# Altium project ArmDebuger_V0.5.PrjPcb
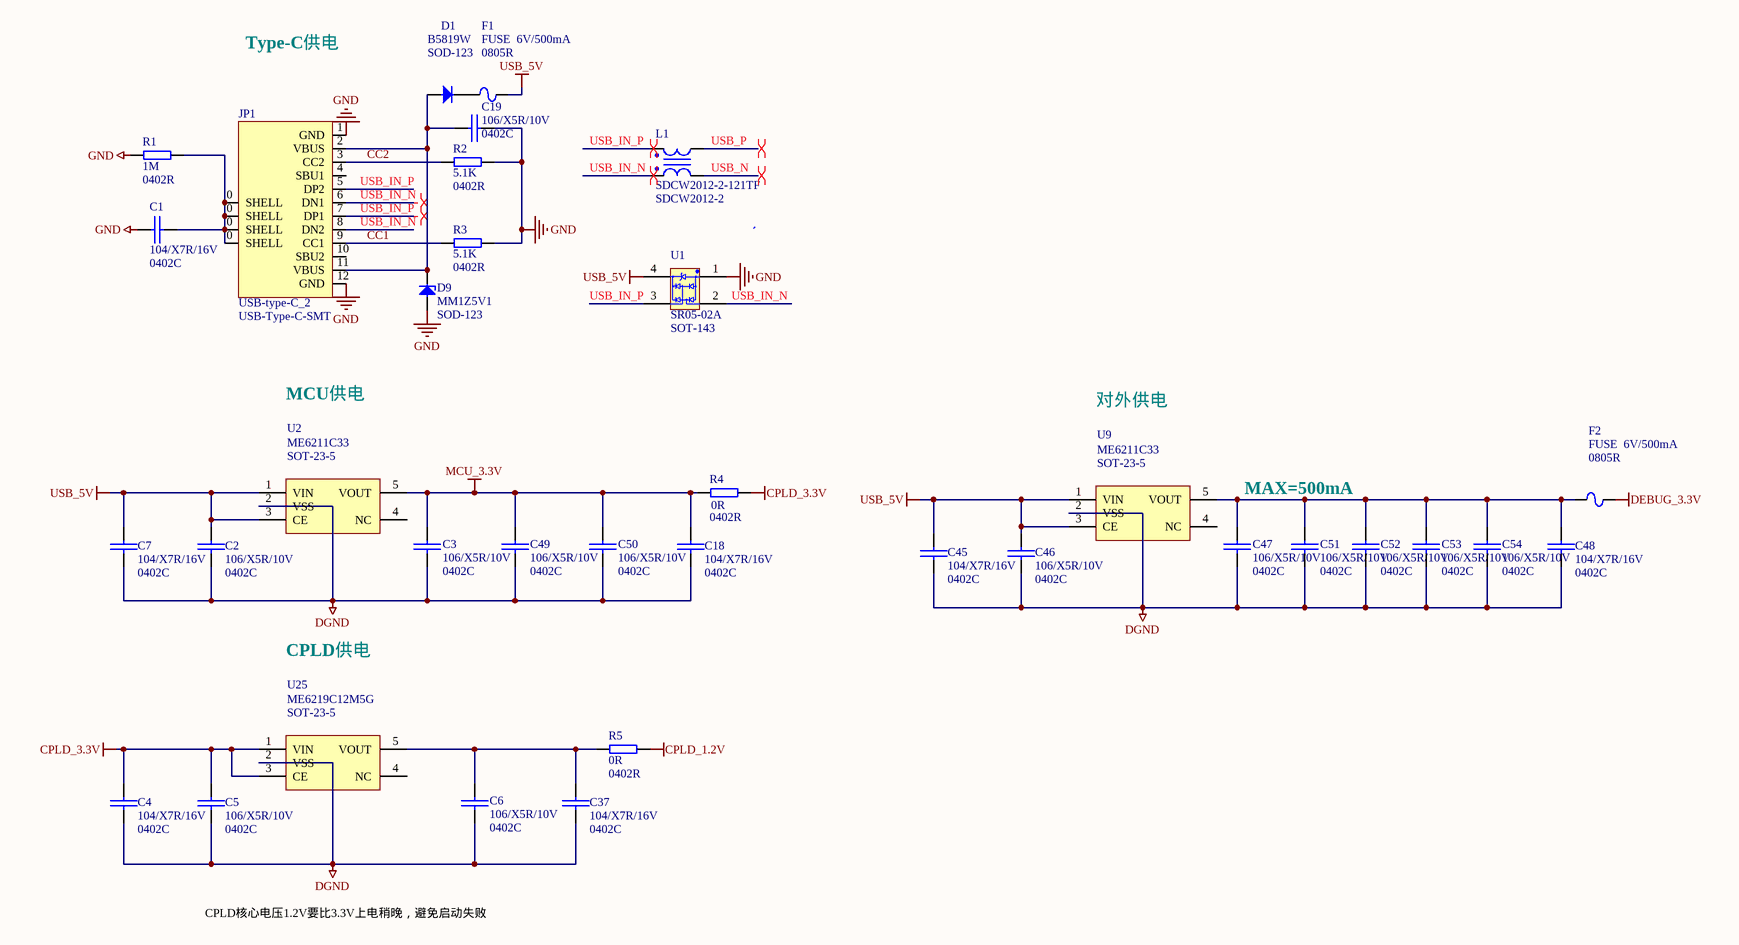
[diagram p0: ArmDebuger(1-7)-POWER.SchDoc]
7 sheets, 167 parts. Net scope: global (net labels, ports and power ports of the same name join across sheets).
Board files: ArmDebuger.PcbDoc, 丝印.PcbDoc
Sheets:
  ArmDebuger(1-7)-POWER.SchDoc
  ArmDebuger(2-7)-HUB.SchDoc
  ArmDebuger(3-7)STLink_V2.SchDoc
  ArmDebuger(4-7)JLink_V9.SchDoc
  ArmDebuger(5-7)DAPLink_V2.SchDoc
  ArmDebuger(6-7)Port.SchDoc
  ArmDebuger(7-7)-CPLD.SchDoc

## Sheet ArmDebuger(1-7)-POWER.SchDoc
size 393 x 241 mm

### Parts
C1  104/X7R/16V  Fp: 0402C  [0402C-SMD-M]
C2  106/X5R/10V  Fp: 0402C  [0402C-SMD-M]
C3  106/X5R/10V  Fp: 0402C  [0402C-SMD-M]
C4  104/X7R/16V  Fp: 0402C  [0402C-SMD-M]
C5  106/X5R/10V  Fp: 0402C  [0402C-SMD-M]
C6  106/X5R/10V  Fp: 0402C  [0402C-SMD-M]
C7  104/X7R/16V  Fp: 0402C  [0402C-SMD-M]
C18  104/X7R/16V  Fp: 0402C  [0402C-SMD-M]
C19  106/X5R/10V  Fp: 0402C  [0402C-SMD-M]
C37  104/X7R/16V  Fp: 0402C  [0402C-SMD-M]
C45  104/X7R/16V  Fp: 0402C  [0402C-SMD-M]
C46  106/X5R/10V  Fp: 0402C  [0402C-SMD-M]
C47  106/X5R/10V  Fp: 0402C  [0402C-SMD-M]
C48  104/X7R/16V  Fp: 0402C  [0402C-SMD-M]
C49  106/X5R/10V  Fp: 0402C  [0402C-SMD-M]
C50  106/X5R/10V  Fp: 0402C  [0402C-SMD-M]
C51  106/X5R/10V  Fp: 0402C  [0402C-SMD-M]
C52  106/X5R/10V  Fp: 0402C  [0402C-SMD-M]
C53  106/X5R/10V  Fp: 0402C  [0402C-SMD-M]
C54  106/X5R/10V  Fp: 0402C  [0402C-SMD-M]
D1  B5819W  [SOD-123]
D9  MM1Z5V1  [SOD-123]
F1  FUSE  6V/500mA  Fp: 0805R  [0805R-SMD-M]
F2  FUSE  6V/500mA  Fp: 0805R  [0805R-SMD-M]
JP1  USB-type-C_2  [USB-Type-C-SMT]
L1  SDCW2012-2-121TF  [SDCW2012-2]
R1  1M  Fp: 0402R  [0402R-SMD-M]
R2  5.1K  Fp: 0402R  [0402R-SMD-M]
R3  5.1K  Fp: 0402R  [0402R-SMD-M]
R4  0R  Fp: 0402R  [0402R-SMD-M]
R5  0R  Fp: 0402R  [0402R-SMD-M]
U1  SR05-02A  [SOT-143]
U2  ME6211C33  [SOT-23-5]
U9  ME6211C33  [SOT-23-5]
U25  ME6219C12M5G  [SOT-23-5]

### Nets
CPLD_1.2V: R5.2
CPLD_3.3V: C4.2 C5.2 R4.2 U25.1(VIN) U25.3(CE)
DEBUG_3.3V: F2.2
DGND: C1.1 C2.1 C3.2 C4.1 C5.1 C6.2 C7.1 C18.1 C19.2 C37.1 C45.1 C46.1 C47.2 C48.1 C49.2 C50.2 C51.2 C52.2 C53.2 C54.2 D9.1(A) JP1.1(GND) JP1.12(GND) R1.1 R2.2 R3.2 U1.1 U2.2(VSS) U9.2(VSS) U25.2(VSS)  [also labelled GND]
MCU_3.3V: C3.1 C18.2 C49.1 C50.1 R4.1 U2.5(VOUT)
USB_5V: C2.2 C7.2 C45.2 C46.2 F1.2 U1.4 U2.1(VIN) U2.3(CE) U9.1(VIN) U9.3(CE)
CC1: JP1.9(CC1) R3.1
CC2: JP1.3(CC2) R2.1
USB_IN_N: JP1.6(DN1) JP1.8(DN2) L1.1 U1.2
USB_IN_P: JP1.5(DP2) JP1.7(DP1) L1.4 U1.3
USB_N: L1.2
USB_P: L1.3
NetC1_2: C1.2 JP1.0(SHELL) R1.2
NetC6_1: C6.1 C37.2 R5.1 U25.5(VOUT)
NetC19_1: C19.1 D1.1(A) D9.2(K) JP1.2(VBUS) JP1.11(VBUS)
NetC47_1: C47.1 C48.2 C51.1 C52.1 C53.1 C54.1 F2.1 U9.5(VOUT)
NetD1_2: D1.2(K) F1.1

Not connected (* = marked no-connect by the designer): JP1 4(SBU1) 10(SBU2); U2 4(NC); U9 4(NC); U25 4(NC)

### Layout directives
differential pair: USB_IN_N, USB_IN_P, USB_N, USB_P

### Notes on the sheet
- Type-C供电
- MCU供电
- 对外供电
- MAX=500mA
- CPLD供电
- CPLD核心电压1.2V要比3.3V上电稍晚，避免启动失败

### Library data of the parts
C1 C4 C7 C18 C37 C45 C48 = CAP: P/N: 06075; LCSC: C60474
C2 C3 C5 C6 C19 C46 C47 C49-C54 = CAP: LCSC: C29266; P/N: ?
D1 = DIODE: P/N: 02036; Fp: SOD-123; LCSC: C8598
D9 = ZENER: P/N: 02031; Fp: SOD-123; LCSC: C112534
F1 F2 = FUSE: LCSC: C66452; P/N: ?
L1 = COMMON MODE COIL: P/N: 09016; Fp: SDCW2012-2; LCSC: C145052
R1 = RES: P/N: 04075; LCSC: C3152068
R2 R3 = RES: P/N: 04160; LCSC: C25905
R4 R5 = RES: P/N: 04150; LCSC: C21376
U1 = SR05-02A: P/N: 02064; Fp: SOT-143; LCSC: C521962
U2 U9 = ME6211: P/N: 01053; Fp: SOT-23-5; LCSC: C82942
U25 = ME6211: P/N: 01128; Fp: SOT-23-5; LCSC: C236651
JP1 = USB-type-C_2: Fp: USB-Type-C-SMT; LCSC: C2765186; P/N: ?

## Sheet ArmDebuger(2-7)-HUB.SchDoc
size 393 x 241 mm
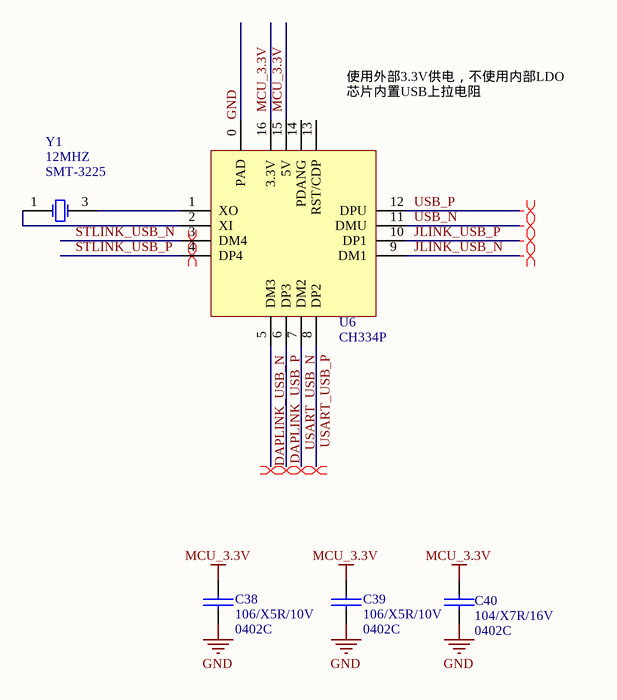
[diagram p1: ArmDebuger(2-7)-HUB.SchDoc]

### Parts
C38  106/X5R/10V  Fp: 0402C  [0402C-SMD-M]
C39  106/X5R/10V  Fp: 0402C  [0402C-SMD-M]
C40  104/X7R/16V  Fp: 0402C  [0402C-SMD-M]
U6  CH334P  [QFN-16]
Y1  12MHZ  Fp: SMT-3225  [CRYSTAL-SMT-3225]

### Nets
GND: C38.2 C39.2 C40.1 U6.0(PAD)  [project net DGND]
MCU_3.3V: C38.1 C39.1 C40.2 U6.15(5V) U6.16(3.3V)
DAPLINK_USB_N: U6.5(DM3)
DAPLINK_USB_P: U6.6(DP3)
JLINK_USB_N: U6.9(DM1)
JLINK_USB_P: U6.10(DP1)
STLINK_USB_N: U6.3(DM4)
STLINK_USB_P: U6.4(DP4)
USART_USB_N: U6.7(DM2)
USART_USB_P: U6.8(DP2)
USB_N: U6.11(DMU)
USB_P: U6.12(DPU)
NetU6_1: U6.1(XO) Y1.3(OSC2)
NetU6_2: U6.2(XI) Y1.1(OSC1)

Not connected (* = marked no-connect by the designer): U6 13(RST/CDP) 14(PDANG)

### Layout directives
differential pair: DAPLINK_USB_N, DAPLINK_USB_P, JLINK_USB_N, JLINK_USB_P, STLINK_USB_N, STLINK_USB_P, USART_USB_N, USART_USB_P, USB_N, USB_P

### Notes on the sheet
- (near U6) 使用外部3.3V供电，不使用内部LDO
  芯片内置USB上拉电阻

### Library data of the parts
C38 C39 = CAP: LCSC: C29266; P/N: ?
C40 = CAP: P/N: 06075; LCSC: C60474
Y1 = SMD-3225_4P  25MHZ 12PF 10PPM: 贴片晶振; P/N: 10009; LCSC: C133334
U6 = CH334P: Fp: QFN-16; P/N: ?; taobao: https://m.tb.cn/h.5UjuFds?tk=QfBrWaFip8v

## Sheet ArmDebuger(3-7)STLink_V2.SchDoc
size 393 x 241 mm
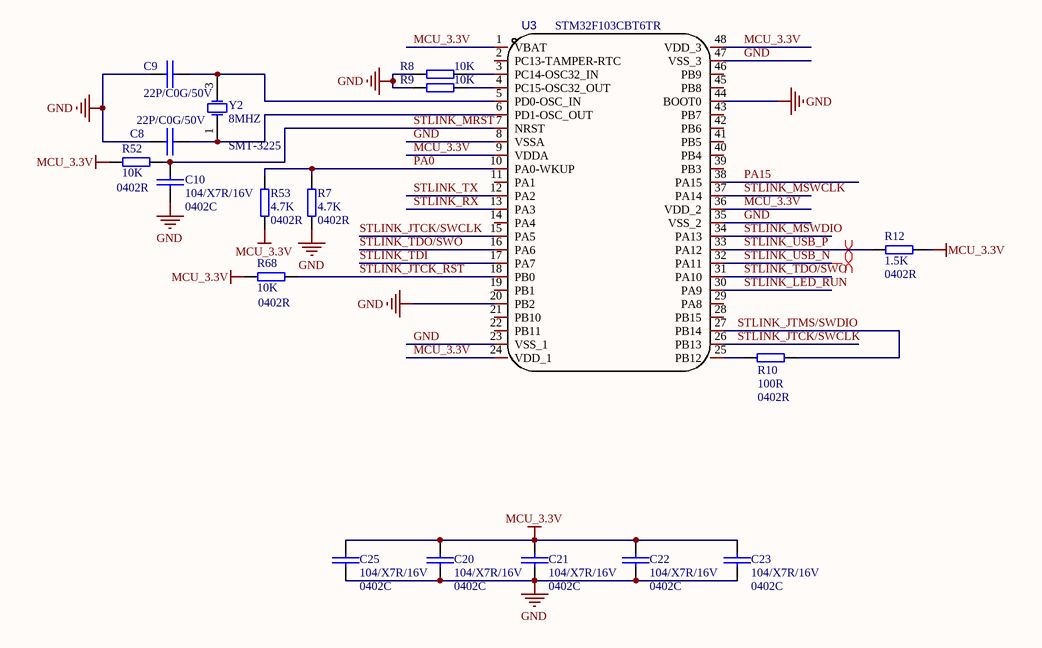
[diagram p2: ArmDebuger(3-7)STLink_V2.SchDoc]

### Parts
C8  22P/C0G/50V  [0402C-SMD-M]
C9  22P/C0G/50V  [0402C-SMD-M]
C10  104/X7R/16V  Fp: 0402C  [0402C-SMD-M]
C20  104/X7R/16V  Fp: 0402C  [0402C-SMD-M]
C21  104/X7R/16V  Fp: 0402C  [0402C-SMD-M]
C22  104/X7R/16V  Fp: 0402C  [0402C-SMD-M]
C23  104/X7R/16V  Fp: 0402C  [0402C-SMD-M]
C25  104/X7R/16V  Fp: 0402C  [0402C-SMD-M]
R7  4.7K  Fp: 0402R  [0402R-SMD-M]
R8  10K  [0402R-SMD-M]
R9  10K  [0402R-SMD-M]
R10  100R  Fp: 0402R  [0402R-SMD-M]
R12  1.5K  Fp: 0402R  [0402R-SMD-M]
R52  10K  Fp: 0402R  [0402R-SMD-M]
R53  4.7K  Fp: 0402R  [0402R-SMD-M]
R68  10K  Fp: 0402R  [0402R-SMD-M]
U3  STM32F103CBT6TR  [LQFP48_L]
Y2  8MHZ  Fp: SMT-3225  [CRYSTAL-SMT-3225]

### Nets
GND: C8.1 C9.1 C10.1 C20.1 C21.1 C22.1 C23.1 C25.1 R7.1 R8.1 R9.1 U3.8(VSSA) U3.20(PB2) U3.23(VSS_1) U3.35(VSS_2) U3.44(BOOT0) U3.47(VSS_3)  [project net DGND]
MCU_3.3V: C20.2 C21.2 C22.2 C23.2 C25.2 R12.1 R52.1 R53.1 R68.1 U3.1(VBAT) U3.9(VDDA) U3.24(VDD_1) U3.36(VDD_2) U3.48(VDD_3)
PA0: R7.2 R53.2 U3.10(PA0-WKUP)
PA15: U3.38(PA15)
STLINK_JTCK/SWCLK: U3.15(PA5) U3.26(PB13)
STLINK_JTCK_RST: R68.2 U3.18(PB0)
STLINK_JTMS/SWDIO: R10.2 U3.27(PB14)
STLINK_LED_RUN: U3.30(PA9)
STLINK_MRST: C10.2 R52.2 U3.7(NRST)
STLINK_MSWCLK: U3.37(PA14)
STLINK_MSWDIO: U3.34(PA13)
STLINK_RX: U3.13(PA3)
STLINK_TDI: U3.17(PA7)
STLINK_TDO/SWO: U3.16(PA6) U3.31(PA10)
STLINK_TX: U3.12(PA2)
STLINK_USB_N: U3.32(PA11)
STLINK_USB_P: R12.2 U3.33(PA12)
NetC8_2: C8.2 U3.6(PD1-OSC_OUT) Y2.1(OSC1)
NetC9_2: C9.2 U3.5(PD0-OSC_IN) Y2.3(OSC2)
NetR8_2: R8.2 U3.3(PC14-OSC32_IN)
NetR9_2: R9.2 U3.4(PC15-OSC32_OUT)
NetR10_1: R10.1 U3.25(PB12)

Not connected (* = marked no-connect by the designer): U3 2(PC13-TAMPER-RTC) 11(PA1) 14(PA4) 19(PB1) 21(PB10) 22(PB11) 28(PB15) 29(PA8) 39(PB3) 40(PB4) 41(PB5) 42(PB6) 43(PB7) 45(PB8) 46(PB9)

### Layout directives
differential pair: STLINK_USB_N, STLINK_USB_P

### Library data of the parts
C8 C9 = CAP: Fp: 0402C; P/N: 06076; LCSC: C167428
C10 C20-C23 C25 = CAP: P/N: 06075; LCSC: C60474
R7 R53 = RES: P/N: 04156; LCSC: C25900
R8 R9 = RES: Fp: 0402R; P/N: 04120; LCSC: C25744
R10 = RES: P/N: 04154; LCSC: C106232
R12 = RES: P/N: 04163; LCSC: C25867
R52 R68 = RES: P/N: 04120; LCSC: C25744
U3 = STM32F103C8T6TR: Fp: LQFP48; P/N: ?; taobao: https://m.tb.cn/h.5UjFpJ6?tk=nM8UWaFiXVg
Y2 = SMD-3225_4P  25MHZ 12PF 10PPM: 贴片晶振; LCSC: C5308002; P/N: ?

## Sheet ArmDebuger(4-7)JLink_V9.SchDoc
size 393 x 241 mm
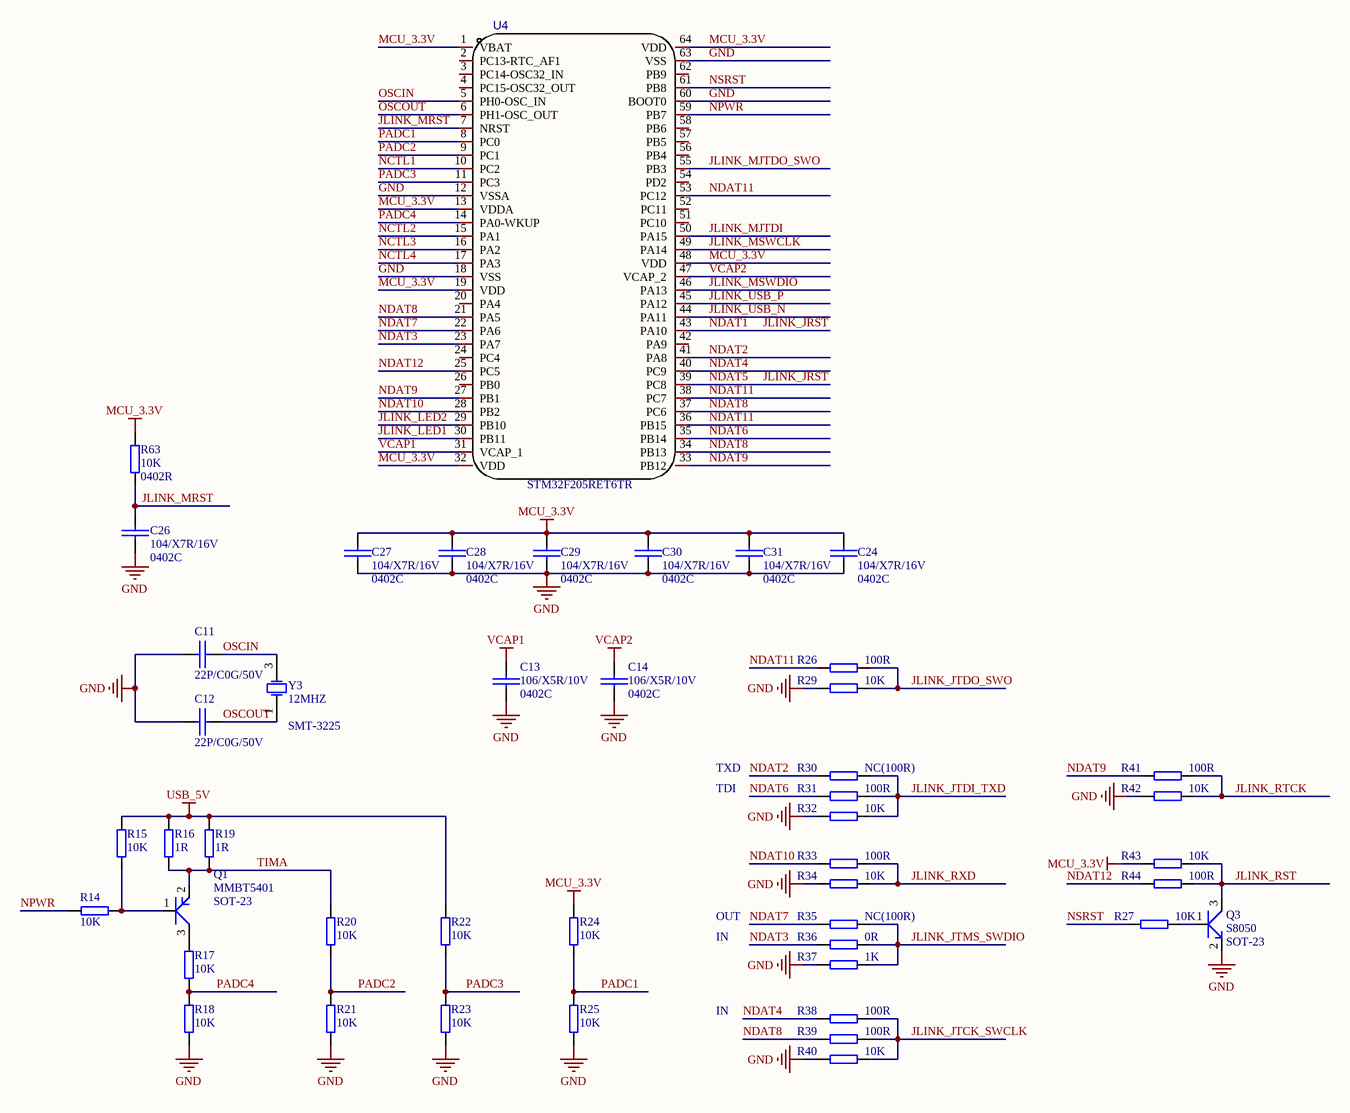
[diagram p3: ArmDebuger(4-7)JLink_V9.SchDoc]

### Parts
C11  22P/C0G/50V  [0402C-SMD-M]
C12  22P/C0G/50V  [0402C-SMD-M]
C13  106/X5R/10V  Fp: 0402C  [0402C-SMD-M]
C14  106/X5R/10V  Fp: 0402C  [0402C-SMD-M]
C24  104/X7R/16V  Fp: 0402C  [0402C-SMD-M]
C26  104/X7R/16V  Fp: 0402C  [0402C-SMD-M]
C27  104/X7R/16V  Fp: 0402C  [0402C-SMD-M]
C28  104/X7R/16V  Fp: 0402C  [0402C-SMD-M]
C29  104/X7R/16V  Fp: 0402C  [0402C-SMD-M]
C30  104/X7R/16V  Fp: 0402C  [0402C-SMD-M]
C31  104/X7R/16V  Fp: 0402C  [0402C-SMD-M]
Q1  MMBT5401  [SOT-23]
Q3  S8050  [SOT-23]
R14  10K  [0402R-SMD-M]
R15  10K  [0402R-SMD-M]
R16  1R  [0402R-SMD-M]
R17  10K  [0402R-SMD-M]
R18  10K  [0402R-SMD-M]
R19  1R  [0402R-SMD-M]
R20  10K  [0402R-SMD-M]
R21  10K  [0402R-SMD-M]
R22  10K  [0402R-SMD-M]
R23  10K  [0402R-SMD-M]
R24  10K  [0402R-SMD-M]
R25  10K  [0402R-SMD-M]
R26  100R  [0402R-SMD-M]
R27  10K  [0402R-SMD-M]
R29  10K  [0402R-SMD-M]
R30  NC(100R)  [0402R-SMD-M]
R31  100R  [0402R-SMD-M]
R32  10K  [0402R-SMD-M]
R33  100R  [0402R-SMD-M]
R34  10K  [0402R-SMD-M]
R35  NC(100R)  [0402R-SMD-M]
R36  0R  [0402R-SMD-M]
R37  1K  [0402R-SMD-M]
R38  100R  [0402R-SMD-M]
R39  100R  [0402R-SMD-M]
R40  10K  [0402R-SMD-M]
R41  100R  [0402R-SMD-M]
R42  10K  [0402R-SMD-M]
R43  10K  [0402R-SMD-M]
R44  100R  [0402R-SMD-M]
R63  10K  Fp: 0402R  [0402R-SMD-M]
U4  STM32F205RET6TR  [LQFP64_L]
Y3  12MHZ  Fp: SMT-3225  [CRYSTAL-SMT-3225]

### Nets
GND: C11.1 C12.1 C13.2 C14.2 C24.1 C26.1 C27.1 C28.1 C29.1 C30.1 C31.1 Q3.2(E) R18.2 R21.2 R23.2 R25.2 R29.1 R32.1 R34.1 R37.1 R40.1 R42.1 U4.12(VSSA) U4.18(VSS) U4.60(BOOT0) U4.63(VSS)  [project net DGND]
MCU_3.3V: C24.2 C27.2 C28.2 C29.2 C30.2 C31.2 R24.1 R43.1 R63.1 U4.1(VBAT) U4.13(VDDA) U4.19(VDD) U4.32(VDD) U4.48(VDD) U4.64(VDD)
USB_5V: R15.2 R16.1 R19.1 R22.1
VCAP1: C13.1 U4.31(VCAP_1)
VCAP2: C14.1 U4.47(VCAP_2)
JLINK_JRST: U4.39(PC8) U4.43(PA10)  [also labelled NDAT1, NDAT5]
JLINK_JTCK_SWCLK: R38.2 R39.2 R40.2
JLINK_JTDI_TXD: R30.2 R31.2 R32.2
JLINK_JTDO_SWO: R26.2 R29.2
JLINK_JTMS_SWDIO: R35.2 R36.2 R37.2
JLINK_LED1: U4.30(PB11)
JLINK_LED2: U4.29(PB10)
JLINK_MJTDI: U4.50(PA15)
JLINK_MJTDO_SWO: U4.55(PB3)
JLINK_MRST: C26.2 R63.2 U4.7(NRST)
JLINK_MSWCLK: U4.49(PA14)
JLINK_MSWDIO: U4.46(PA13)
JLINK_RST: Q3.3(C) R43.2 R44.2
JLINK_RTCK: R41.2 R42.2
JLINK_RXD: R33.2 R34.2
JLINK_USB_N: U4.44(PA11)
JLINK_USB_P: U4.45(PA12)
NCTL1: U4.10(PC2)
NCTL2: U4.15(PA1)
NCTL3: U4.16(PA2)
NCTL4: U4.17(PA3)
NDAT2: R30.1 U4.41(PA8)
NDAT3: R36.1 U4.23(PA7)
NDAT4: R38.1 U4.40(PC9)
NDAT6: R31.1 U4.35(PB14)
NDAT7: R35.1 U4.22(PA6)
NDAT8: R39.1 U4.21(PA5) U4.34(PB13) U4.37(PC6)
NDAT9: R41.1 U4.27(PB1) U4.33(PB12)
NDAT10: R33.1 U4.28(PB2)
NDAT11: R26.1 U4.36(PB15) U4.38(PC7) U4.53(PC12)
NDAT12: R44.1 U4.25(PC5)
NPWR: R14.2 U4.59(PB7)
NSRST: R27.1 U4.61(PB8)
OSCIN: C11.2 U4.5(PH0-OSC_IN) Y3.3(OSC2)
OSCOUT: C12.2 U4.6(PH1-OSC_OUT) Y3.1(OSC1)
PADC1: R24.2 R25.1 U4.8(PC0)
PADC2: R20.2 R21.1 U4.9(PC1)
PADC3: R22.2 R23.1 U4.11(PC3)
PADC4: R17.2 R18.1 U4.14(PA0-WKUP)
TIMA: Q1.2(E) R16.2 R19.2 R20.1
NetQ1_1: Q1.1(B) R14.1 R15.1
NetQ1_3: Q1.3(C) R17.1
NetQ3_1: Q3.1(B) R27.2

Not connected (* = marked no-connect by the designer): U4 2(PC13-RTC_AF1) 3(PC14-OSC32_IN) 4(PC15-OSC32_OUT) 20(PA4) 24(PC4) 26(PB0) 42(PA9) 51(PC10) 52(PC11) 54(PD2) 56(PB4) 57(PB5) 58(PB6) 62(PB9)

### Notes on the sheet
- TXD
- TDI
- OUT
- IN

### Library data of the parts
C11 C12 = CAP: Fp: 0402C; P/N: 06076; LCSC: C167428
C13 C14 = CAP: LCSC: C29266; P/N: ?
C24 C26-C31 = CAP: P/N: 06075; LCSC: C60474
Q1 = PNP-BEC: P/N: 02019; Fp: SOT-23; LCSC: C8326
Q3 = NPN-BEC: P/N: 02007; Fp: SOT-23; LCSC: C2891804
R14 R15 R17 R18 R20-R25 R27 R29 R32 R34 R40 R42 R43 = RES: Fp: 0402R; P/N: 04120; LCSC: C25744
R16 R19 = RES: Fp: 0402R; LCSC: C25086; P/N: ?
R26 R31 R33 R38 R39 R41 R44 = RES: Fp: 0402R; P/N: 04154; LCSC: C106232
R30 R35 = RES: Fp: 0402R; P/N: NC(04154); LCSC: NC
R36 = RES: Fp: 0402R; P/N: 04150; LCSC: C21376
R37 = RES: Fp: 0402R; P/N: 04123; LCSC: C11702
R63 = RES: P/N: 04120; LCSC: C25744
U4 = STM32F205RET6TR: Fp: LQFP64; P/N: ?; taobao: https://m.tb.cn/h.551KmY1?tk=9z7YWaFRN6v
Y3 = SMD-3225_4P  25MHZ 12PF 10PPM: 贴片晶振; P/N: 10009; LCSC: C133334

## Sheet ArmDebuger(5-7)DAPLink_V2.SchDoc
size 393 x 241 mm
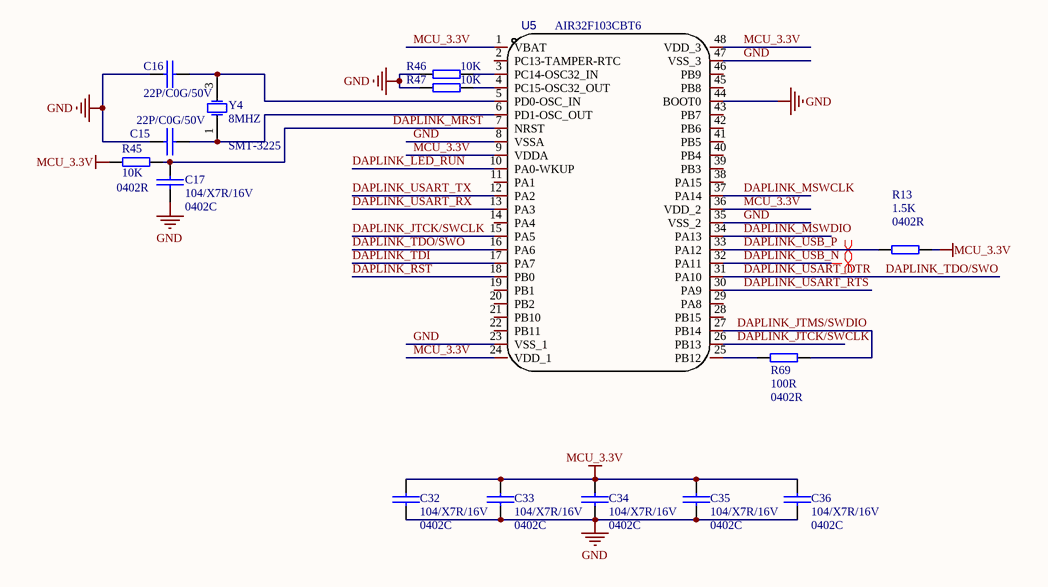
[diagram p4: ArmDebuger(5-7)DAPLink_V2.SchDoc]

### Parts
C15  22P/C0G/50V  [0402C-SMD-M]
C16  22P/C0G/50V  [0402C-SMD-M]
C17  104/X7R/16V  Fp: 0402C  [0402C-SMD-M]
C32  104/X7R/16V  Fp: 0402C  [0402C-SMD-M]
C33  104/X7R/16V  Fp: 0402C  [0402C-SMD-M]
C34  104/X7R/16V  Fp: 0402C  [0402C-SMD-M]
C35  104/X7R/16V  Fp: 0402C  [0402C-SMD-M]
C36  104/X7R/16V  Fp: 0402C  [0402C-SMD-M]
R13  1.5K  Fp: 0402R  [0402R-SMD-M]
R45  10K  Fp: 0402R  [0402R-SMD-M]
R46  10K  [0402R-SMD-M]
R47  10K  [0402R-SMD-M]
R69  100R  Fp: 0402R  [0402R-SMD-M]
U5  AIR32F103CBT6  [LQFP48_L]
Y4  8MHZ  Fp: SMT-3225  [CRYSTAL-SMT-3225]

### Nets
GND: C15.1 C16.1 C17.1 C32.1 C33.1 C34.1 C35.1 C36.1 R46.1 R47.1 U5.8(VSSA) U5.23(VSS_1) U5.35(VSS_2) U5.44(BOOT0) U5.47(VSS_3)  [project net DGND]
MCU_3.3V: C32.2 C33.2 C34.2 C35.2 C36.2 R13.1 R45.1 U5.1(VBAT) U5.9(VDDA) U5.24(VDD_1) U5.36(VDD_2) U5.48(VDD_3)
DAPLINK_JTCK/SWCLK: U5.15(PA5) U5.26(PB13)
DAPLINK_JTMS/SWDIO: R69.2 U5.27(PB14)
DAPLINK_LED_RUN: U5.10(PA0-WKUP)
DAPLINK_MRST: C17.2 R45.2 U5.7(NRST)
DAPLINK_MSWCLK: U5.37(PA14)
DAPLINK_MSWDIO: U5.34(PA13)
DAPLINK_RST: U5.18(PB0)
DAPLINK_TDI: U5.17(PA7)
DAPLINK_TDO/SWO: U5.16(PA6) U5.31(PA10)  [also labelled DAPLINK_USART_DTR]
DAPLINK_USART_RTS: U5.30(PA9)
DAPLINK_USART_RX: U5.13(PA3)
DAPLINK_USART_TX: U5.12(PA2)
DAPLINK_USB_N: U5.32(PA11)
DAPLINK_USB_P: R13.2 U5.33(PA12)
NetC15_2: C15.2 U5.6(PD1-OSC_OUT) Y4.1(OSC1)
NetC16_2: C16.2 U5.5(PD0-OSC_IN) Y4.3(OSC2)
NetR46_2: R46.2 U5.3(PC14-OSC32_IN)
NetR47_2: R47.2 U5.4(PC15-OSC32_OUT)
NetR69_1: R69.1 U5.25(PB12)

Not connected (* = marked no-connect by the designer): U5 2(PC13-TAMPER-RTC) 11(PA1) 14(PA4) 19(PB1) 20(PB2) 21(PB10) 22(PB11) 28(PB15) 29(PA8) 38(PA15) 39(PB3) 40(PB4) 41(PB5) 42(PB6) 43(PB7) 45(PB8) 46(PB9)

### Layout directives
differential pair: DAPLINK_USB_N, DAPLINK_USB_P

### Library data of the parts
C15 C16 = CAP: Fp: 0402C; P/N: 06076; LCSC: C167428
C17 C32-C36 = CAP: P/N: 06075; LCSC: C60474
R13 = RES: P/N: 04163; LCSC: C25867
R45 = RES: P/N: 04120; LCSC: C25744
R46 R47 = RES: Fp: 0402R; P/N: 04120; LCSC: C25744
R69 = RES: P/N: 04154; LCSC: C106232
U5 = STM32F103C8T6TR: Fp: LQFP48; P/N: ?; taobao: https://m.tb.cn/h.5TjcyDk?tk=32YdWb073vn
Y4 = SMD-3225_4P  25MHZ 12PF 10PPM: 贴片晶振; LCSC: C5308002; P/N: ?

## Sheet ArmDebuger(6-7)Port.SchDoc
size 393 x 241 mm
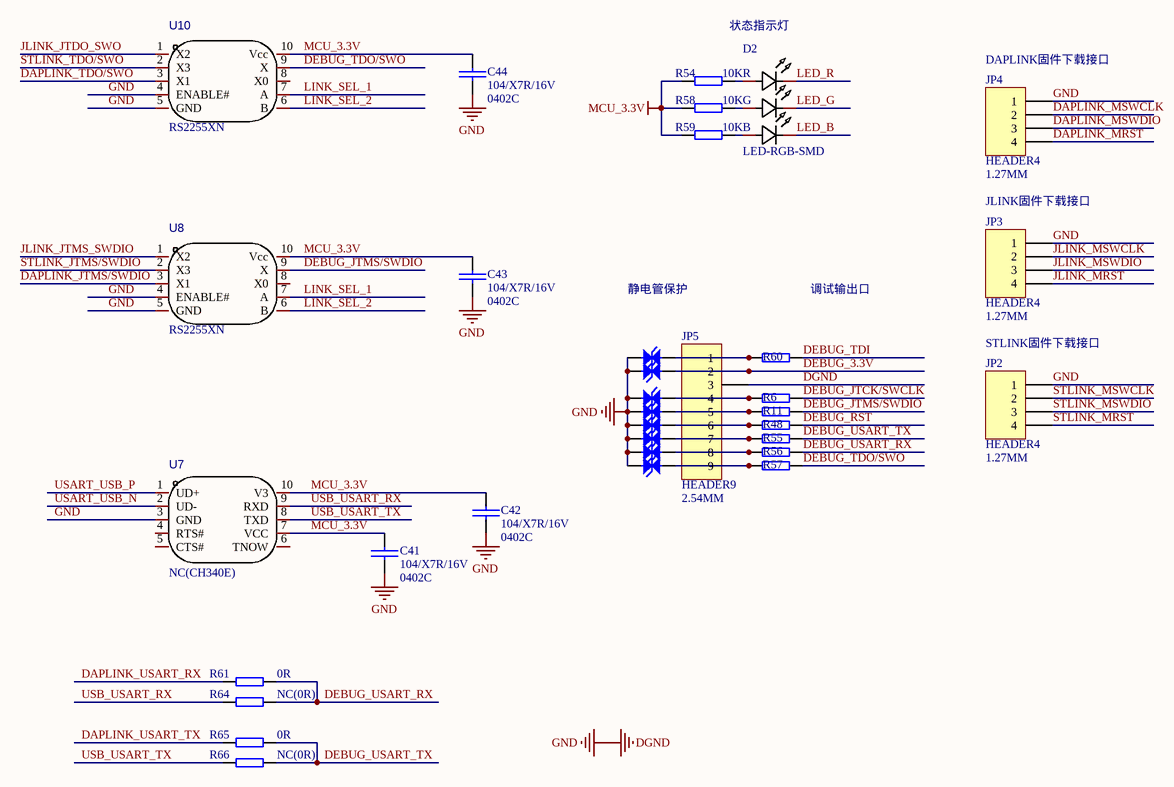
[diagram p5: ArmDebuger(6-7)Port.SchDoc]

### Parts
C41  104/X7R/16V  Fp: 0402C  [0402C-SMD-M]
C42  104/X7R/16V  Fp: 0402C  [0402C-SMD-M]
C43  104/X7R/16V  Fp: 0402C  [0402C-SMD-M]
C44  104/X7R/16V  Fp: 0402C  [0402C-SMD-M]
D2  LED-RGB-SMD  [LED-SMD-6P]
ED1  KESD3.3V52D-C  [SOD-523]  (value not drawn)
ED2  KESD3.3V52D-C  [SOD-523]  (value not drawn)
ED3  KESD3.3V52D-C  [SOD-523]  (value not drawn)
ED4  KESD3.3V52D-C  [SOD-523]  (value not drawn)
ED5  KESD3.3V52D-C  [SOD-523]  (value not drawn)
ED6  KESD3.3V52D-C  [SOD-523]  (value not drawn)
ED7  KESD3.3V52D-C  [SOD-523]  (value not drawn)
ED8  KESD3.3V52D-C  [SOD-523]  (value not drawn)
JP2  HEADER4  Fp: 1.27MM  [HDR-1X4-1.27MM]
JP3  HEADER4  Fp: 1.27MM  [HDR-1X4-1.27MM]
JP4  HEADER4  Fp: 1.27MM  [HDR-1X4-1.27MM]
JP5  HEADER9  Fp: 2.54MM  [Header-1x9]
R6  100R  [0402R-SMD-M]  (value not drawn)
R11  100R  [0402R-SMD-M]  (value not drawn)
R48  100R  [0402R-SMD-M]  (value not drawn)
R54  10K  [0402R-SMD-M]
R55  100R  [0402R-SMD-M]  (value not drawn)
R56  100R  [0402R-SMD-M]  (value not drawn)
R57  100R  [0402R-SMD-M]  (value not drawn)
R58  10K  [0402R-SMD-M]
R59  10K  [0402R-SMD-M]
R60  100R  [0402R-SMD-M]  (value not drawn)
R61  0R  [0402R-SMD-M]
R64  NC(0R)  [0402R-SMD-M]
R65  0R  [0402R-SMD-M]
R66  NC(0R)  [0402R-SMD-M]
U7  NC(CH340E)  [MSOP-10-L]
U8  RS2255XN  [MSOP-10-L]
U10  RS2255XN  [MSOP-10-L]

### Nets
DEBUG_3.3V: ED7.1(A) JP5.2
DGND: C41.1 C42.1 C43.1 C44.1 ED1.2(K) ED2.2(K) ED3.2(K) ED4.2(K) ED5.2(K) ED6.2(K) ED7.2(K) ED8.2(K) JP2.1 JP3.1 JP4.1 JP5.3 U7.3(GND) U8.4(ENABLE#) U8.5(GND) U10.4(ENABLE#) U10.5(GND)  [also labelled GND]
MCU_3.3V: C41.2 C42.2 C43.2 C44.2 R54.1 R58.1 R59.1 U7.7(VCC) U7.10(V3) U8.10(Vcc) U10.10(Vcc)
DAPLINK_JTMS/SWDIO: U8.3(X1)
DAPLINK_MRST: JP4.4
DAPLINK_MSWCLK: JP4.2
DAPLINK_MSWDIO: JP4.3
DAPLINK_TDO/SWO: U10.3(X1)
DAPLINK_USART_RX: R61.2
DAPLINK_USART_TX: R65.2
DEBUG_JTCK/SWCLK: R6.2
DEBUG_JTMS/SWDIO: R11.2 U8.9(X)
DEBUG_RST: R48.2
DEBUG_TDI: R60.2
DEBUG_TDO/SWO: R57.2 U10.9(X)
DEBUG_USART_RX: R56.2 R61.1 R64.1
DEBUG_USART_TX: R55.2 R65.1 R66.1
JLINK_JTDO_SWO: U10.1(X2)
JLINK_JTMS_SWDIO: U8.1(X2)
JLINK_MRST: JP3.4
JLINK_MSWCLK: JP3.2
JLINK_MSWDIO: JP3.3
LED_B: D2.4(-)
LED_G: D2.5(-)
LED_R: D2.6(-)
LINK_SEL_1: U8.7(A) U10.7(A)
LINK_SEL_2: U8.6(B) U10.6(B)
STLINK_JTMS/SWDIO: U8.2(X3)
STLINK_MRST: JP2.4
STLINK_MSWCLK: JP2.2
STLINK_MSWDIO: JP2.3
STLINK_TDO/SWO: U10.2(X3)
USART_USB_N: U7.2(UD-)
USART_USB_P: U7.1(UD+)
USB_USART_RX: R64.2 U7.9(RXD)
USB_USART_TX: R66.2 U7.8(TXD)
NetD2_1: D2.1(R) R54.2
NetD2_2: D2.2(G) R58.2
NetD2_3: D2.3(B) R59.2
NetED1_1: ED1.1(A) JP5.9 R57.1
NetED2_1: ED2.1(A) JP5.7 R55.1
NetED3_1: ED3.1(A) JP5.5 R11.1
NetED4_1: ED4.1(A) JP5.4 R6.1
NetED5_1: ED5.1(A) JP5.8 R56.1
NetED6_1: ED6.1(A) JP5.6 R48.1
NetED8_1: ED8.1(A) JP5.1 R60.1

Not connected (* = marked no-connect by the designer): U7 4(RTS#) 5(CTS#) 6(TNOW); U8 8(X0); U10 8(X0)

### Notes on the sheet
- 状态指示灯
- (near JP4) DAPLINK固件下载接口
- JLINK固件下载接口
- 静电管保护
- 调试输出口
- STLINK固件下载接口

### Library data of the parts
C41-C44 = CAP: P/N: 06075; LCSC: C60474
D2 = LED-RGB-SMD: Fp: SMD3535; LCSC: C784546; P/N: ?
ED1-ED8 = ESD: P/N: 02035; Fp: SOD-523; LCSC: C2892515
R6 R11 R48 R55-R57 R60 = RES: Fp: 0402R; P/N: 04154; LCSC: C106232
R54 R58 R59 = RES: Fp: 0402R; P/N: 04120; LCSC: C25744
R61 R65 = RES: Fp: 0402R; P/N: 04150; LCSC: C21376
R64 R66 = RES: Fp: 0402R; P/N: NC(04150); LCSC: NC
U7 = CH340E: Fp: MSOP-10; LCSC: NC; P/N: NC
U8 U10 = RS2255XN: Fp: MSOP-10; LCSC: C783421; P/N: ?
JP2-JP4 = HEADER4: LCSC: NC
JP5 = HEADER9: LCSC: NC

## Sheet ArmDebuger(7-7)-CPLD.SchDoc
size A4
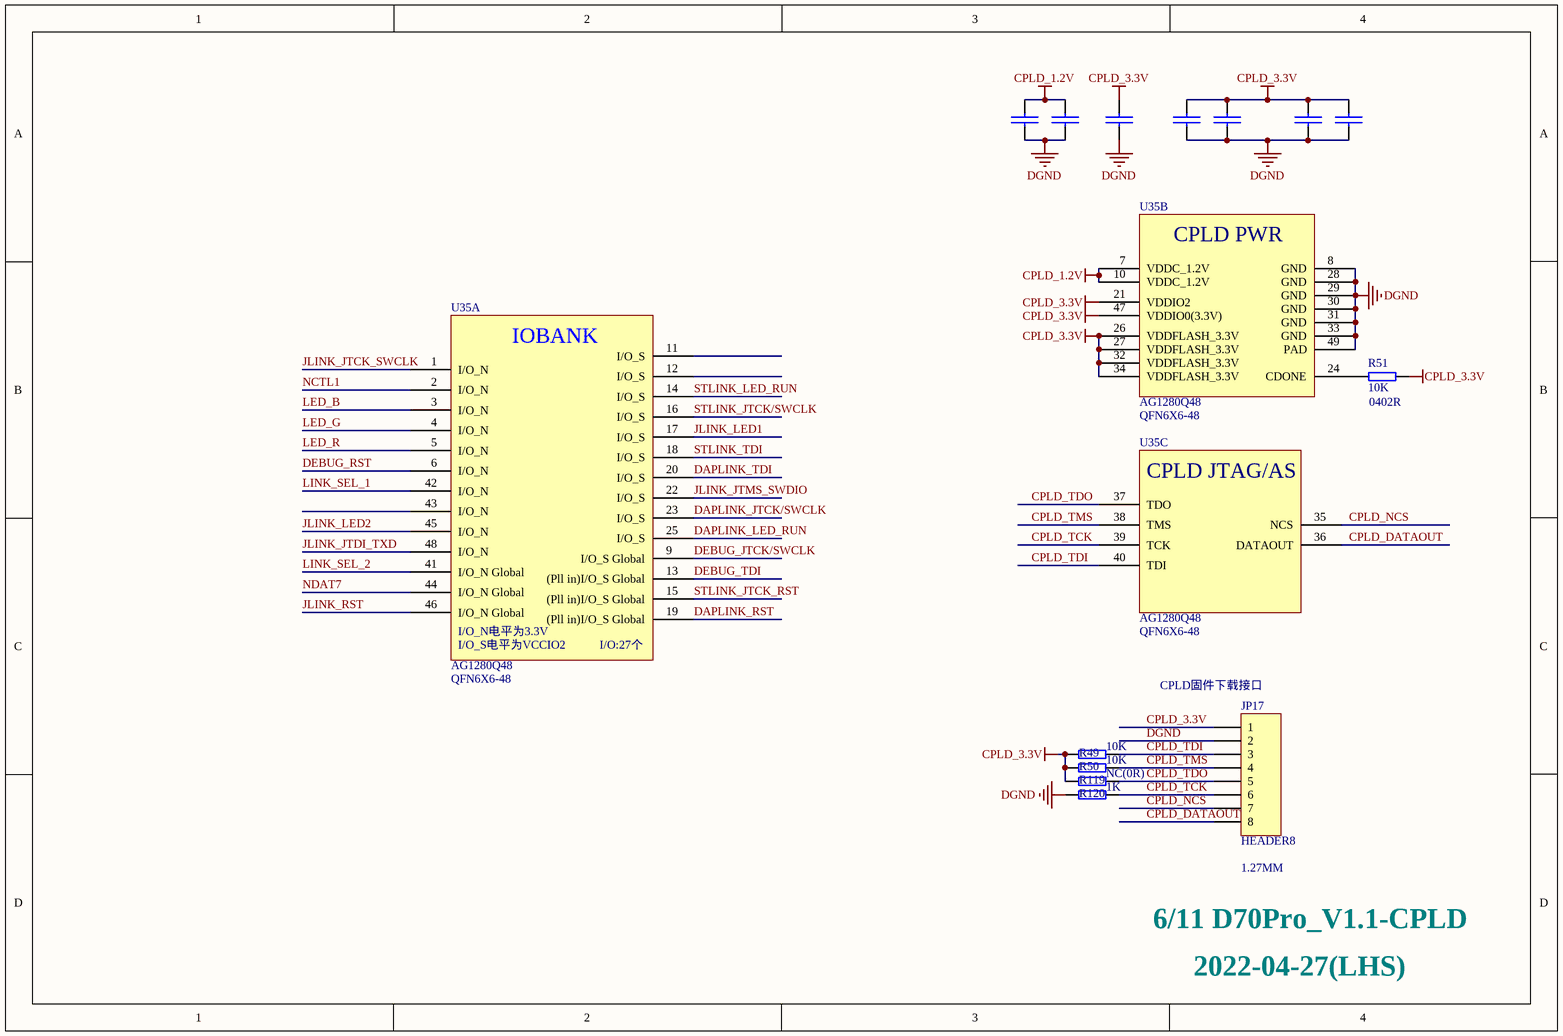
[diagram p6: ArmDebuger(7-7)-CPLD.SchDoc]

### Parts
C105  104/X7R/16V  [0402C-SMD-M]  (value not drawn)
C172  104/X7R/16V  [0402C-SMD-M]  (value not drawn)
C223  104/X7R/16V  [0402C-SMD-M]  (value not drawn)
C224  104/X7R/16V  [0402C-SMD-M]  (value not drawn)
C227  104/X7R/16V  [0402C-SMD-M]  (value not drawn)
C228  104/X7R/16V  [0402C-SMD-M]  (value not drawn)
C229  104/X7R/16V  [0402C-SMD-M]  (value not drawn)
JP17  HEADER8  Fp: 1.27MM  [HEADER4x2-1.27mm]
R49  10K  [0402R-SMD-M]
R50  10K  [0402R-SMD-M]
R51  10K  Fp: 0402R  [0402R-SMD-M]
R119  NC(0R)  [0402R-SMD-M]
R120  1K  [0402R-SMD-M]
U35  AG1280Q48  [QFN6X6-48]  (parts A,B,C of 3)

### Nets
CPLD_1.2V: C105.2 C229.1 U35.7(VDDC_1.2V) U35.10(VDDC_1.2V)
CPLD_3.3V: C172.2 C223.2 C224.2 C227.2 C228.2 JP17.1 R49.2 R50.2 R51.1 R119.2 U35.21(VDDIO2) U35.26(VDDFLASH_3.3V) U35.27(VDDFLASH_3.3V) U35.32(VDDFLASH_3.3V) U35.34(VDDFLASH_3.3V) U35.47(VDDIO0(3.3V))
DGND: C105.1 C172.1 C223.1 C224.1 C227.1 C228.1 C229.2 JP17.2 R120.2 U35.8(GND) U35.28(GND) U35.29(GND) U35.30(GND) U35.31(GND) U35.33(GND) U35.49(PAD)
CPLD_DATAOUT: JP17.8 U35.36(DATAOUT)
CPLD_NCS: JP17.7 U35.35(NCS)
CPLD_TCK: JP17.6 R120.1 U35.39(TCK)
CPLD_TDI: JP17.3 R49.1 U35.40(TDI)
CPLD_TDO: JP17.5 R119.1 U35.37(TDO)
CPLD_TMS: JP17.4 R50.1 U35.38(TMS)
DAPLINK_JTCK/SWCLK: U35.23(I/O_S)
DAPLINK_LED_RUN: U35.25(I/O_S)
DAPLINK_RST: U35.19((Pll_in)I/O_S_Global)
DAPLINK_TDI: U35.20(I/O_S)
DEBUG_JTCK/SWCLK: U35.9(I/O_S_Global)
DEBUG_RST: U35.6(I/O_N)
DEBUG_TDI: U35.13((Pll_in)I/O_S_Global)
JLINK_JTCK_SWCLK: U35.1(I/O_N)
JLINK_JTDI_TXD: U35.48(I/O_N)
JLINK_JTMS_SWDIO: U35.22(I/O_S)
JLINK_LED1: U35.17(I/O_S)
JLINK_LED2: U35.45(I/O_N)
JLINK_RST: U35.46(I/O_N_Global)
LED_B: U35.3(I/O_N)
LED_G: U35.4(I/O_N)
LED_R: U35.5(I/O_N)
LINK_SEL_1: U35.42(I/O_N)
LINK_SEL_2: U35.41(I/O_N_Global)
NCTL1: U35.2(I/O_N)
NDAT7: U35.44(I/O_N_Global)
STLINK_JTCK/SWCLK: U35.16(I/O_S)
STLINK_JTCK_RST: U35.15((Pll_in)I/O_S_Global)
STLINK_LED_RUN: U35.14(I/O_S)
STLINK_TDI: U35.18(I/O_S)
NetR51_2: R51.2 U35.24(CDONE)

Not connected (* = marked no-connect by the designer): U35 11(I/O_S) 12(I/O_S) 43(I/O_N)

### Notes on the sheet
- (near U35) I/O:27个
- (near JP17) CPLD固件下载接口
- 6/11 D70Pro_V1.1-CPLD
- 2022-04-27(LHS)
- (in symbol AG1280Q48, part A) IOBANK; I/O_N电平为3.3V; I/O_S电平为VCCIO2
- (in symbol AG1280Q48, part B) CPLD PWR
- (in symbol AG1280Q48, part C) CPLD JTAG/AS

### Library data of the parts
C105 C172 C223 C224 C227-C229 = CAP: Fp: 0402C; P/N: 06075; LCSC: C60474
R49 R50 = RES: Fp: 0402R; P/N: 04120; LCSC: C25744
R51 = RES: P/N: 04120; LCSC: C25744
R119 = RES: Fp: 0402R; P/N: NC(04150); LCSC: NC
R120 = RES: Fp: 0402R; P/N: 04123; LCSC: C11702
JP17 = HEADER8: LCSC: NC
U35 = AG1280Q48: Fp: QFN6X6-48; P/N: ?; taobao: https://m.tb.cn/h.5UjIJER?tk=o2YQWaF6f0s

## Nets that join several sheets
CPLD_1.2V: ArmDebuger(1-7)-POWER (R5.2), ArmDebuger(7-7)-CPLD (C105.2 C229.1 U35.7 U35.10)
CPLD_3.3V: ArmDebuger(1-7)-POWER (5 pins), ArmDebuger(7-7)-CPLD (16 pins)
DEBUG_3.3V: ArmDebuger(1-7)-POWER (F2.2), ArmDebuger(6-7)Port (ED7.1 JP5.2)
DGND: ArmDebuger(1-7)-POWER (30 pins), ArmDebuger(2-7)-HUB (C38.2 C39.2 C40.1 U6.0), ArmDebuger(3-7)STLink_V2 (17 pins), ArmDebuger(4-7)JLink_V9 (26 pins), ArmDebuger(5-7)DAPLink_V2 (15 pins), ArmDebuger(6-7)Port (21 pins), ArmDebuger(7-7)-CPLD (16 pins)
MCU_3.3V: ArmDebuger(1-7)-POWER (6 pins), ArmDebuger(2-7)-HUB (5 pins), ArmDebuger(3-7)STLink_V2 (14 pins), ArmDebuger(4-7)JLink_V9 (15 pins), ArmDebuger(5-7)DAPLink_V2 (12 pins), ArmDebuger(6-7)Port (11 pins)
USB_5V: ArmDebuger(1-7)-POWER (10 pins), ArmDebuger(4-7)JLink_V9 (R15.2 R16.1 R19.1 R22.1)
DAPLINK_JTCK/SWCLK: ArmDebuger(5-7)DAPLink_V2 (U5.15 U5.26), ArmDebuger(7-7)-CPLD (U35.23)
DAPLINK_JTMS/SWDIO: ArmDebuger(5-7)DAPLink_V2 (R69.2 U5.27), ArmDebuger(6-7)Port (U8.3)
DAPLINK_LED_RUN: ArmDebuger(5-7)DAPLink_V2 (U5.10), ArmDebuger(7-7)-CPLD (U35.25)
DAPLINK_MRST: ArmDebuger(5-7)DAPLink_V2 (C17.2 R45.2 U5.7), ArmDebuger(6-7)Port (JP4.4)
DAPLINK_MSWCLK: ArmDebuger(5-7)DAPLink_V2 (U5.37), ArmDebuger(6-7)Port (JP4.2)
DAPLINK_MSWDIO: ArmDebuger(5-7)DAPLink_V2 (U5.34), ArmDebuger(6-7)Port (JP4.3)
DAPLINK_RST: ArmDebuger(5-7)DAPLink_V2 (U5.18), ArmDebuger(7-7)-CPLD (U35.19)
DAPLINK_TDI: ArmDebuger(5-7)DAPLink_V2 (U5.17), ArmDebuger(7-7)-CPLD (U35.20)
DAPLINK_TDO/SWO: ArmDebuger(5-7)DAPLink_V2 (U5.16 U5.31), ArmDebuger(6-7)Port (U10.3)
DAPLINK_USART_RX: ArmDebuger(5-7)DAPLink_V2 (U5.13), ArmDebuger(6-7)Port (R61.2)
DAPLINK_USART_TX: ArmDebuger(5-7)DAPLink_V2 (U5.12), ArmDebuger(6-7)Port (R65.2)
DAPLINK_USB_N: ArmDebuger(2-7)-HUB (U6.5), ArmDebuger(5-7)DAPLink_V2 (U5.32)
DAPLINK_USB_P: ArmDebuger(2-7)-HUB (U6.6), ArmDebuger(5-7)DAPLink_V2 (R13.2 U5.33)
DEBUG_JTCK/SWCLK: ArmDebuger(6-7)Port (R6.2), ArmDebuger(7-7)-CPLD (U35.9)
DEBUG_RST: ArmDebuger(6-7)Port (R48.2), ArmDebuger(7-7)-CPLD (U35.6)
DEBUG_TDI: ArmDebuger(6-7)Port (R60.2), ArmDebuger(7-7)-CPLD (U35.13)
JLINK_JTCK_SWCLK: ArmDebuger(4-7)JLink_V9 (R38.2 R39.2 R40.2), ArmDebuger(7-7)-CPLD (U35.1)
JLINK_JTDI_TXD: ArmDebuger(4-7)JLink_V9 (R30.2 R31.2 R32.2), ArmDebuger(7-7)-CPLD (U35.48)
JLINK_JTDO_SWO: ArmDebuger(4-7)JLink_V9 (R26.2 R29.2), ArmDebuger(6-7)Port (U10.1)
JLINK_JTMS_SWDIO: ArmDebuger(4-7)JLink_V9 (R35.2 R36.2 R37.2), ArmDebuger(6-7)Port (U8.1), ArmDebuger(7-7)-CPLD (U35.22)
JLINK_LED1: ArmDebuger(4-7)JLink_V9 (U4.30), ArmDebuger(7-7)-CPLD (U35.17)
JLINK_LED2: ArmDebuger(4-7)JLink_V9 (U4.29), ArmDebuger(7-7)-CPLD (U35.45)
JLINK_MRST: ArmDebuger(4-7)JLink_V9 (C26.2 R63.2 U4.7), ArmDebuger(6-7)Port (JP3.4)
JLINK_MSWCLK: ArmDebuger(4-7)JLink_V9 (U4.49), ArmDebuger(6-7)Port (JP3.2)
JLINK_MSWDIO: ArmDebuger(4-7)JLink_V9 (U4.46), ArmDebuger(6-7)Port (JP3.3)
JLINK_RST: ArmDebuger(4-7)JLink_V9 (Q3.3 R43.2 R44.2), ArmDebuger(7-7)-CPLD (U35.46)
JLINK_USB_N: ArmDebuger(2-7)-HUB (U6.9), ArmDebuger(4-7)JLink_V9 (U4.44)
JLINK_USB_P: ArmDebuger(2-7)-HUB (U6.10), ArmDebuger(4-7)JLink_V9 (U4.45)
LED_B: ArmDebuger(6-7)Port (D2.4), ArmDebuger(7-7)-CPLD (U35.3)
LED_G: ArmDebuger(6-7)Port (D2.5), ArmDebuger(7-7)-CPLD (U35.4)
LED_R: ArmDebuger(6-7)Port (D2.6), ArmDebuger(7-7)-CPLD (U35.5)
LINK_SEL_1: ArmDebuger(6-7)Port (U8.7 U10.7), ArmDebuger(7-7)-CPLD (U35.42)
LINK_SEL_2: ArmDebuger(6-7)Port (U8.6 U10.6), ArmDebuger(7-7)-CPLD (U35.41)
NCTL1: ArmDebuger(4-7)JLink_V9 (U4.10), ArmDebuger(7-7)-CPLD (U35.2)
NDAT7: ArmDebuger(4-7)JLink_V9 (R35.1 U4.22), ArmDebuger(7-7)-CPLD (U35.44)
STLINK_JTCK/SWCLK: ArmDebuger(3-7)STLink_V2 (U3.15 U3.26), ArmDebuger(7-7)-CPLD (U35.16)
STLINK_JTCK_RST: ArmDebuger(3-7)STLink_V2 (R68.2 U3.18), ArmDebuger(7-7)-CPLD (U35.15)
STLINK_JTMS/SWDIO: ArmDebuger(3-7)STLink_V2 (R10.2 U3.27), ArmDebuger(6-7)Port (U8.2)
STLINK_LED_RUN: ArmDebuger(3-7)STLink_V2 (U3.30), ArmDebuger(7-7)-CPLD (U35.14)
STLINK_MRST: ArmDebuger(3-7)STLink_V2 (C10.2 R52.2 U3.7), ArmDebuger(6-7)Port (JP2.4)
STLINK_MSWCLK: ArmDebuger(3-7)STLink_V2 (U3.37), ArmDebuger(6-7)Port (JP2.2)
STLINK_MSWDIO: ArmDebuger(3-7)STLink_V2 (U3.34), ArmDebuger(6-7)Port (JP2.3)
STLINK_TDI: ArmDebuger(3-7)STLink_V2 (U3.17), ArmDebuger(7-7)-CPLD (U35.18)
STLINK_TDO/SWO: ArmDebuger(3-7)STLink_V2 (U3.16 U3.31), ArmDebuger(6-7)Port (U10.2)
STLINK_USB_N: ArmDebuger(2-7)-HUB (U6.3), ArmDebuger(3-7)STLink_V2 (U3.32)
STLINK_USB_P: ArmDebuger(2-7)-HUB (U6.4), ArmDebuger(3-7)STLink_V2 (R12.2 U3.33)
USART_USB_N: ArmDebuger(2-7)-HUB (U6.7), ArmDebuger(6-7)Port (U7.2)
USART_USB_P: ArmDebuger(2-7)-HUB (U6.8), ArmDebuger(6-7)Port (U7.1)
USB_N: ArmDebuger(1-7)-POWER (L1.2), ArmDebuger(2-7)-HUB (U6.11)
USB_P: ArmDebuger(1-7)-POWER (L1.3), ArmDebuger(2-7)-HUB (U6.12)